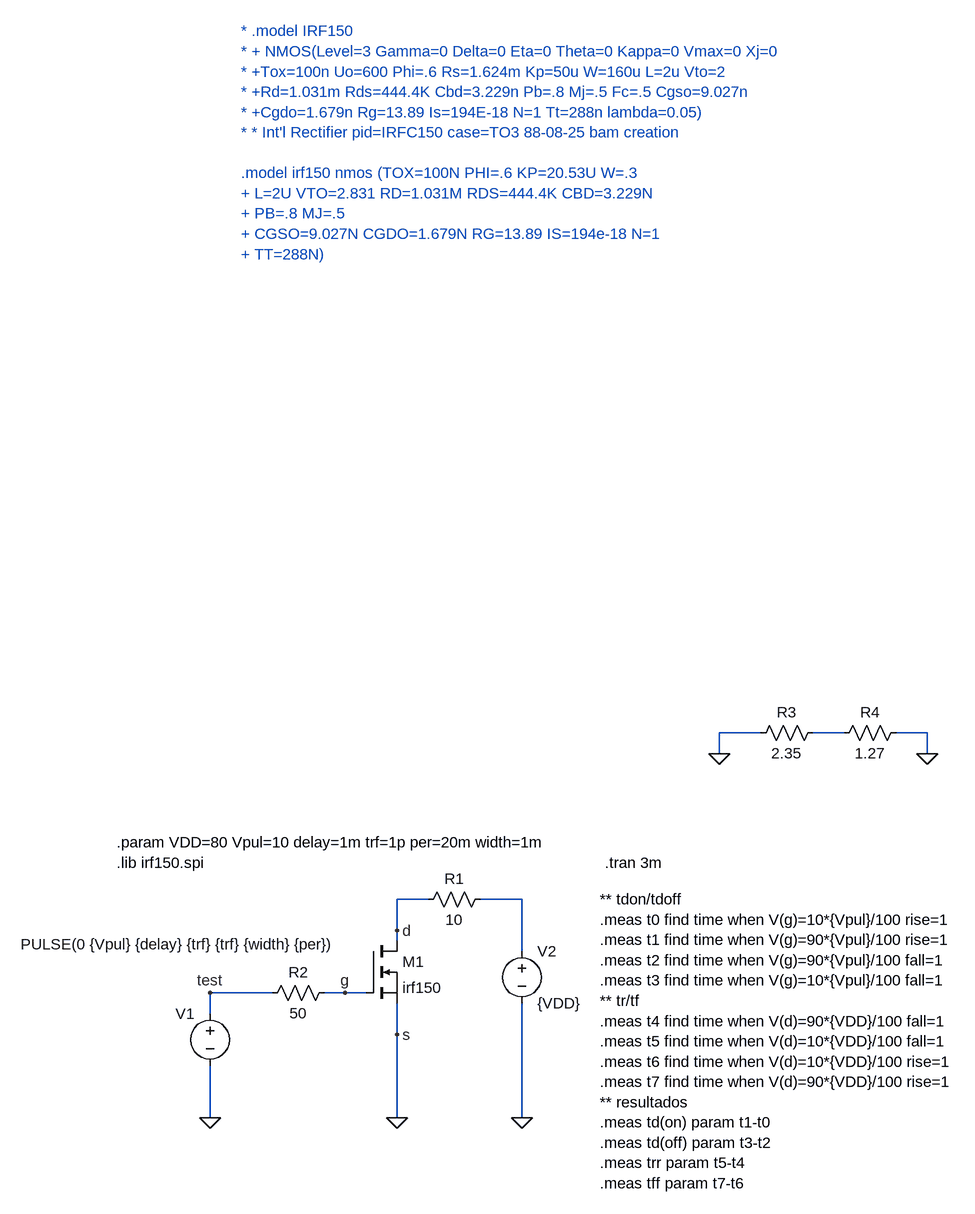
[diagram p0: schematic pwrMos.asc]
pwrMos.asc, the LTspice schematic file:
Version 4
SHEET 1 944 808
WIRE 432 -256 368 -256
WIRE 560 -256 512 -256
WIRE 688 -256 640 -256
WIRE 368 -224 368 -256
WIRE 688 -224 688 -256
WIRE -80 0 -128 0
WIRE 64 0 0 0
WIRE -128 48 -128 0
WIRE -128 64 -128 48
WIRE 64 80 64 0
WIRE -320 144 -416 144
WIRE -208 144 -240 144
WIRE -176 144 -208 144
WIRE -416 176 -416 144
WIRE -128 208 -128 160
WIRE -416 336 -416 256
WIRE -128 336 -128 208
WIRE 64 336 64 160
FLAG -128 336 0
FLAG -416 336 0
FLAG 64 336 0
FLAG -208 144 g
FLAG -128 48 d
FLAG -128 208 s
FLAG -416 144 test
FLAG 688 -224 0
FLAG 368 -224 0
SYMBOL nmos -176 64 R0
SYMATTR InstName M1
SYMATTR Value irf150
SYMATTR Prefix x
SYMBOL voltage -416 160 M0
WINDOW 3 -197 -91 Left 2
WINDOW 123 0 0 Left 0
WINDOW 39 0 0 Left 0
SYMATTR Value PULSE(0 {Vpul} {delay} {trf} {trf} {width} {per})
SYMATTR InstName V1
SYMBOL res 16 -16 R90
WINDOW 0 0 56 VBottom 2
WINDOW 3 32 56 VTop 2
SYMATTR InstName R1
SYMATTR Value 10
SYMBOL res -224 128 R90
WINDOW 0 0 56 VBottom 2
WINDOW 3 32 56 VTop 2
SYMATTR InstName R2
SYMATTR Value 50
SYMBOL voltage 64 64 R0
WINDOW 123 0 0 Left 0
WINDOW 39 0 0 Left 0
SYMATTR InstName V2
SYMATTR Value {VDD}
SYMBOL res 528 -272 R90
WINDOW 0 0 56 VBottom 2
WINDOW 3 32 56 VTop 2
SYMATTR InstName R3
SYMATTR Value 2.35
SYMBOL res 656 -272 R90
WINDOW 0 0 56 VBottom 2
WINDOW 3 32 56 VTop 2
SYMATTR InstName R4
SYMATTR Value 1.27
TEXT -560 -56 Left 2 !.lib irf150.spi
TEXT -368 -1336 Left 2 ;* .model IRF150\n* + NMOS(Level=3 Gamma=0 Delta=0 Eta=0 Theta=0 Kappa=0 Vmax=0 Xj=0\n* +Tox=100n Uo=600 Phi=.6 Rs=1.624m Kp=50u W=160u L=2u Vto=2\n* +Rd=1.031m Rds=444.4K Cbd=3.229n Pb=.8 Mj=.5 Fc=.5 Cgso=9.027n\n* +Cgdo=1.679n Rg=13.89 Is=194E-18 N=1 Tt=288n lambda=0.05)\n* * Int'l Rectifier pid=IRFC150 case=TO3 88-08-25 bam creation\n \n.model irf150 nmos (TOX=100N PHI=.6 KP=20.53U W=.3\n+ L=2U VTO=2.831 RD=1.031M RDS=444.4K CBD=3.229N\n+ PB=.8 MJ=.5\n+ CGSO=9.027N CGDO=1.679N RG=13.89 IS=194e-18 N=1\n+ TT=288N)
TEXT -560 -88 Left 2 !.param VDD=80 Vpul=10 delay=1m trf=1p per=20m width=1m
TEXT 192 -56 Left 2 !.tran 3m
TEXT 184 0 Left 2 !** tdon/tdoff\n.meas t0 find time when V(g)=10*{Vpul}/100 rise=1\n.meas t1 find time when V(g)=90*{Vpul}/100 rise=1\n.meas t2 find time when V(g)=90*{Vpul}/100 fall=1\n.meas t3 find time when V(g)=10*{Vpul}/100 fall=1\n** tr/tf\n.meas t4 find time when V(d)=90*{VDD}/100 fall=1\n.meas t5 find time when V(d)=10*{VDD}/100 fall=1\n.meas t6 find time when V(d)=10*{VDD}/100 rise=1\n.meas t7 find time when V(d)=90*{VDD}/100 rise=1\n** resultados\n.meas td(on) param t1-t0\n.meas td(off) param t3-t2\n.meas trr param t5-t4\n.meas tff param t7-t6

The netlist it stands for:
* pwrMos.asc
XM1 d g 0 irf150  ; pins D G S
V1 test 0 PULSE(0 {Vpul} {delay} {trf} {trf} {width} {per})
R1 N002 d 10
R2 g test 50
V2 N002 0 {VDD}
R3 N001 0 2.35
R4 0 N001 1.27
.lib irf150.spi
* * .model IRF150
* * + NMOS(Level=3 Gamma=0 Delta=0 Eta=0 Theta=0 Kappa=0 Vmax=0 Xj=0
* * +Tox=100n Uo=600 Phi=.6 Rs=1.624m Kp=50u W=160u L=2u Vto=2
* * +Rd=1.031m Rds=444.4K Cbd=3.229n Pb=.8 Mj=.5 Fc=.5 Cgso=9.027n
* * +Cgdo=1.679n Rg=13.89 Is=194E-18 N=1 Tt=288n lambda=0.05)
* * * Int'l Rectifier pid=IRFC150 case=TO3 88-08-25 bam creation
* .model irf150 nmos (TOX=100N PHI=.6 KP=20.53U W=.3
* + L=2U VTO=2.831 RD=1.031M RDS=444.4K CBD=3.229N
* + PB=.8 MJ=.5
* + CGSO=9.027N CGDO=1.679N RG=13.89 IS=194e-18 N=1
* + TT=288N)
.param VDD=80 Vpul=10 delay=1m trf=1p per=20m width=1m
.tran 3m
** tdon/tdoff
.meas t0 find time when V(g)=10*{Vpul}/100 rise=1
.meas t1 find time when V(g)=90*{Vpul}/100 rise=1
.meas t2 find time when V(g)=90*{Vpul}/100 fall=1
.meas t3 find time when V(g)=10*{Vpul}/100 fall=1
** tr/tf
.meas t4 find time when V(d)=90*{VDD}/100 fall=1
.meas t5 find time when V(d)=10*{VDD}/100 fall=1
.meas t6 find time when V(d)=10*{VDD}/100 rise=1
.meas t7 find time when V(d)=90*{VDD}/100 rise=1
** resultados
.meas td(on) param t1-t0
.meas td(off) param t3-t2
.meas trr param t5-t4
.meas tff param t7-t6
.backanno
.end